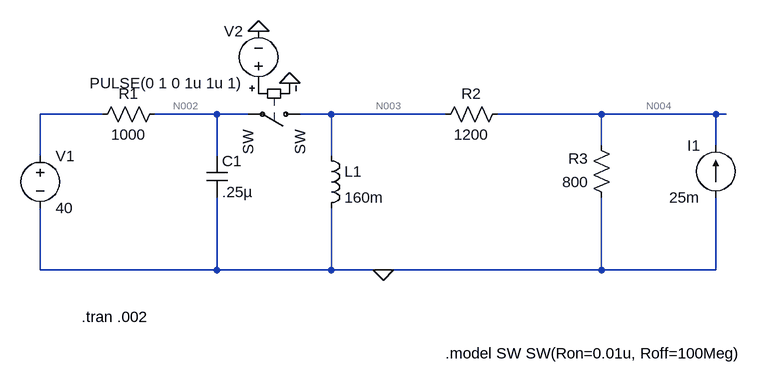
[diagram p0: schematic PSS7.asc]
PSS7.asc, the LTspice schematic file:
Version 4.1
SHEET 1 1120 680
WIRE 96 0 0 0
WIRE 272 0 176 0
WIRE 320 0 272 0
WIRE 448 0 400 0
WIRE 624 0 448 0
WIRE 864 0 704 0
WIRE 1040 0 864 0
WIRE 1056 0 1040 0
WIRE 864 48 864 0
WIRE 1040 48 1040 0
WIRE 0 64 0 0
WIRE 272 64 272 0
WIRE 448 64 448 0
WIRE 0 240 0 144
WIRE 272 240 272 128
WIRE 272 240 0 240
WIRE 448 240 448 144
WIRE 448 240 272 240
WIRE 528 240 448 240
WIRE 864 240 864 128
WIRE 864 240 528 240
WIRE 1040 240 1040 128
WIRE 1040 240 864 240
FLAG 384 -48 0
FLAG 336 -128 0
FLAG 528 240 0
SYMBOL voltage 0 48 R0
SYMATTR InstName V1
SYMATTR Value 40
SYMBOL res 192 -16 R90
WINDOW 0 0 56 VBottom 2
WINDOW 3 32 56 VTop 2
SYMATTR InstName R1
SYMATTR Value 1000
SYMBOL cap 256 64 R0
SYMATTR InstName C1
SYMATTR Value .25µ
SYMBOL ind 432 48 R0
SYMATTR InstName L1
SYMATTR Value 160m
SYMBOL res 720 -16 R90
WINDOW 0 0 56 VBottom 2
WINDOW 3 32 56 VTop 2
SYMATTR InstName R2
SYMATTR Value 1200
SYMBOL res 880 144 R180
WINDOW 0 36 76 Left 2
WINDOW 3 36 40 Left 2
SYMATTR InstName R3
SYMATTR Value 800
SYMBOL current 1040 128 R180
WINDOW 0 24 80 Left 2
WINDOW 3 24 0 Left 2
SYMATTR InstName I1
SYMATTR Value 25m
SYMBOL sw 416 0 R90
SYMATTR InstName SW
SYMBOL voltage 336 -32 R180
WINDOW 0 24 96 Left 2
WINDOW 3 24 16 Left 2
WINDOW 123 0 0 Left 0
WINDOW 39 0 0 Left 0
SYMATTR InstName V2
SYMATTR Value PULSE(0 1 0 1u 1u 1)
TEXT 624 368 Left 2 !.model SW SW(Ron=0.01u, Roff=100Meg)
TEXT 64 312 Left 2 !.tran .002

The netlist it stands for:
* PSS7.asc
V1 N001 0 40
R1 N002 N001 1000
C1 N002 0 .25µ
L1 N003 0 160m
R2 N004 N003 1200
R3 0 N004 800
I1 0 N004 25m
SW N003 N002 P001 0 SW
V2 P001 0 PULSE(0 1 0 1u 1u 1)
.model SW SW(Ron=0.01u, Roff=100Meg)
.tran .002
.backanno
.end

* Results of the author's LTspice run, read from the files saved beside the schematic
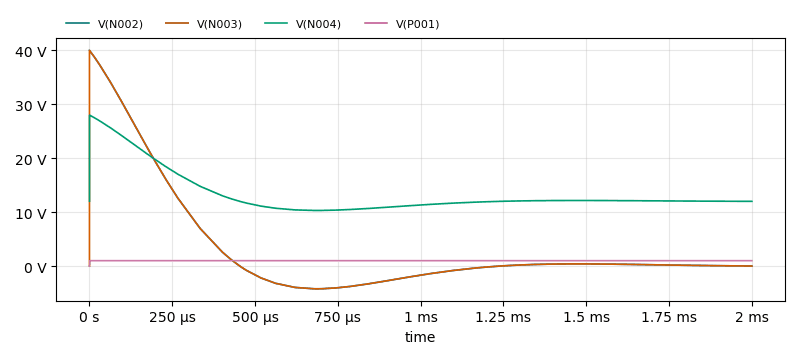
[diagram p1: Transient Analysis of PSS7.asc, plotted from the saved traces]
* Transient Analysis, 1 run:
*   V(N002): min -4.216 V, max 40 V, average 3.218 V, rms 10.48 V, last 10.14 mV
*   V(N003): min -4.216 V, max 40 V, average 3.218 V, rms 10.48 V, last 10.14 mV
*   V(N004): min 10.31 V, max 28 V, average 13.29 V, rms 13.87 V, last 12 V
*   V(P001): min 0 V, max 1 V, average 999.8 mV, rms 999.8 mV, last 1 V